# EAGLE design one_dollar_boad_beta4 (EAGLE 7.2.0)
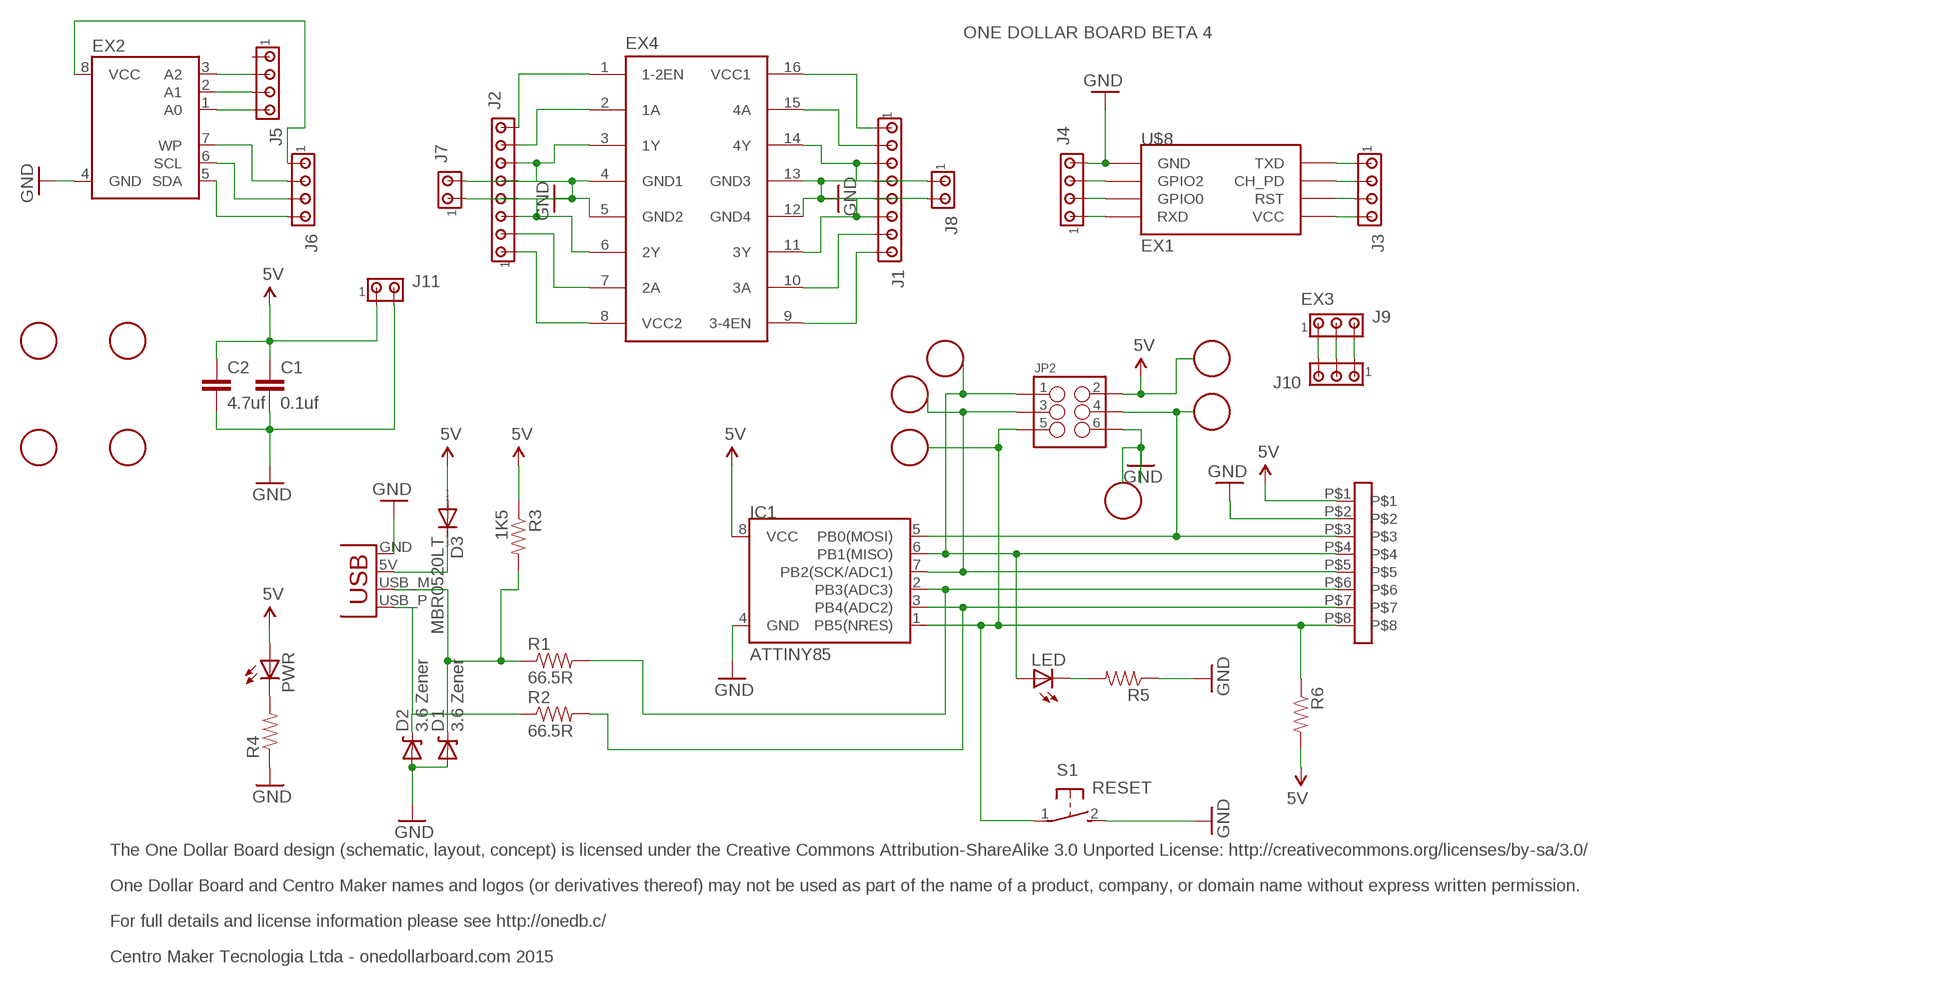
[diagram p0: schematic, sheet 1]

## Parts
C1  0.1uf  CAP0402-CAP  [0402-CAP]
C2  4.7uf  CAP0805  [0805]
CONNECTORBAR1  .  FAMALEBAR01X08  [FEMEABARRA01X08]
D1  3.6 Zener  DIODE-ZENER-BZT52  [SOD-323]
D2  3.6 Zener  DIODE-ZENER-BZT52  [SOD-323]
D3  MBR0520LT  [SOD123]
EX2  AT24CP  [DIL08]
EX4  L293D  [DIL16]
IC1  ATTINY85  ATTINY45  [SO08-EIAJ]
ICSP1  ICSP  [ICSP]
ICSP2  ICSP  [ICSP]
ICSP3  ICSP  [ICSP]
ICSP4  ICSP  [ICSP]
ICSP5  ICSP  [ICSP]
ICSP6  ICSP  [ICSP]
J1  MTA08-100  [10X08MTA]
J2  MTA08-100  [10X08MTA]
J3  MTA04-100  [10X04MTA]
J4  MTA04-100  [10X04MTA]
J5  MTA04-100  [10X04MTA]
J6  MTA04-100  [10X04MTA]
J7  MTA02-100  [10X02MTA]
J8  MTA02-100  [10X02MTA]
J9  MTA03-100  [10X03MTA]
J10  MTA03-100  [10X03MTA]
J11  MTA02-100  [10X02MTA]
JP2  M03X22X3_SILK_MALE_PTH  [2X3]
LED  LED0603  [LED-0603]
PWR  LED0603  [LED-0603]
R1  66.5R  RESISTOR0402-RES  [0402-RES]
R2  66.5R  RESISTOR0402-RES  [0402-RES]
R3  1K5  RESISTOR0402-RES  [0402-RES]
R4  RESISTOR0402-RES  [0402-RES]
R5  RESISTOR0402-RES  [0402-RES]
R6  RESISTOR0402-RES  [0402-RES]
S1  RESET  DTSM-3  [DTSM-3]
U$8  EX1  ESP01  [ESP01]
U$9  ARDUINOPINAGEM  [ARDUINOPINAGEM]
X1  USBPCB  [USB-A-PCB]

## Nets
5V: C1.1 C2.1 CONNECTORBAR1.P$1 D3.A IC1.8(VCC) J11.1 JP2.2 PWR.A R3.1 R6.2
EX1: EX4.15(4A) J1.2
GND: C1.2 C2.2 CONNECTORBAR1.P$2 D1.2(A) D2.2(A) EX2.4(GND) EX4.4(GND1) EX4.5(GND2) EX4.12(GND4) EX4.13(GND3) IC1.4(GND) J1.4 J1.5 J2.4 J2.5 J4.4 J11.2 JP2.6 R4.1 R5.1 S1.2 U$8.GND X1.GND
N$1: J9.1 J10.3
N$2: CONNECTORBAR1.P$3 IC1.5(PB0(MOSI)) JP2.4
N$3: CONNECTORBAR1.P$4 IC1.6(PB1(MISO)) JP2.1 LED.A
N$5: CONNECTORBAR1.P$5 IC1.7(PB2(SCK/ADC1)) JP2.3
N$6: CONNECTORBAR1.P$7 IC1.3(PB4(ADC2)) R2.2
N$7: EX4.1(1-2EN) J2.8
N$9: EX4.2(1A) J2.7
N$10: D1.1(C) R1.1 R3.2 X1.USB_M(D-)
N$11: D2.1(C) R2.1 X1.USB_P(D+)
N$12: LED.C R5.2
N$13: EX2.8(VCC) J6.1
N$14: EX2.7(WP) J6.2
N$15: EX4.3(1Y) J2.6 J7.2
N$16: D3.C X1.5V(VBUS)
N$17: PWR.C R4.2
N$18: EX4.8(VCC2) J2.1
N$19: EX4.7(2A) J2.2
N$20: EX4.6(2Y) J2.3 J7.1
N$21: EX4.16(VCC1) J1.1
N$23: EX2.6(SCL) J6.3
N$24: EX2.5(SDA) J6.4
N$25: EX4.14(4Y) J1.3 J8.1
N$26: EX4.9(3-4EN) J1.8
N$27: EX4.10(3A) J1.7
N$28: EX2.3(A2) J5.2
N$29: J4.3 U$8.GPIO2
N$30: J4.2 U$8.GPIO0
N$31: J4.1 U$8.RX(RXD)
N$32: J3.1 U$8.TX(TXD)
N$33: J3.2 U$8.CH_PD
N$34: J3.3 U$8.RST
N$35: J3.4 U$8.VCC
N$36: EX2.2(A1) J5.3
N$37: EX2.1(A0) J5.4
N$38: EX4.11(3Y) J1.6 J8.2
N$41: J9.2 J10.2
N$46: CONNECTORBAR1.P$6 IC1.2(PB3(ADC3)) R1.2
N$47: CONNECTORBAR1.P$8 IC1.1(PB5(NRES)) JP2.5 R6.1 S1.1
N$48: J9.3 J10.1
Unconnected: J5.1

## Notes on the sheet
- ONE DOLLAR BOARD BETA 4
- EX3
- The One Dollar Board design (schematic, layout, concept) is licensed under the Creative Commons Attribution-ShareAlike 3.0 Unported License: http://creativecommons.org/licenses/by-sa/3.0/
- One Dollar Board and Centro Maker names and logos (or derivatives thereof) may not be used as part of the name of a product, company, or domain name without express written permission.
- For full details and license information please see http://onedb.c/
- Centro Maker Tecnologia Ltda - onedollarboard.com 2015

## Library data of the parts
C1 C2 = SparkFun:CAP: Capacitor Standard 0603 ceramic capacitor, and 0.1" leaded capacitor.
CONNECTORBAR1 = femeabarra01x08:FAMALEBAR01X08: conector barra femea 01x08 SMD
D1 D2 = SparkFun:DIODE-ZENER: Zener Diode Production Part - 8199 3.4V Zener Voltage
D3 = diode:MBR0520LT: SCHOTTKY BARRIER RECTIFIER Source: http://onsemi.com .. MBR0520LT1-D.pdf
EX2 = atmel:AT24C*: 2-wire serial EEPROM; MPN: AT24C1024BW-SH-B; OC_FARNELL: 1362646; OC_NEWARK: 03P2044
EX4 = st-microelectronics:L293D: PUSH-PULL 4 CHANNEL DRIVER; MPN: L293D; OC_FARNELL: 9589619; OC_NEWARK: 56P8249
IC1 = SparkFun:ATTINY45: Atmel ATTiny45
ICSP1-ICSP6 = ICSP:ICSP
J1 J2 = con-amp:MTA08-100: AMP connector
J3-J6 = con-amp:MTA04-100: AMP connector
J7 J8 J11 = con-amp:MTA02-100: AMP connector
J9 J10 = con-amp:MTA03-100: AMP connector
JP2 = SparkFun-Connectors:M03X2: 2x3 .1" header. Shrouded, with keying- CONN-10681 SMT- CONN-11415 Pogo pins- HW-11044; PROD_ID: CONN-09701
LED PWR = SparkFun:LED: LEDs Standard schematic elements and footprints for 5mm, 3mm, 1206, and 0603 sized LEDs. 5mm - Spark Fun Electronics SKU : COM-00529 (and others)
R1-R6 = SparkFun:RESISTOR: Resistor Basic schematic elements and footprints for 0603, 1206, and PTH resistors.
S1 = switch-tact:DTSM-3
U$8 = esp8266modules:ESP01: ESP8266 Wifi module 01
U$9 = arduinopinagem:ARDUINOPINAGEM
X1 = SparkFun:USB: USB Connectors USB-B-PTH is fully proven SKU : PRT-00139 USB-miniB is fully proven SKU : PRT-00587 USB-A-PCB is untested. USB-A-H is throughly reviewed, but untested. Spark Fun Electronics SKU : PRT-00437 USB-B-SMT is throughly reviewed, but untested. Needs silkscreen touching up. USB-A-S has not been used/tested USB-MB-H has not been used/tested

## Board
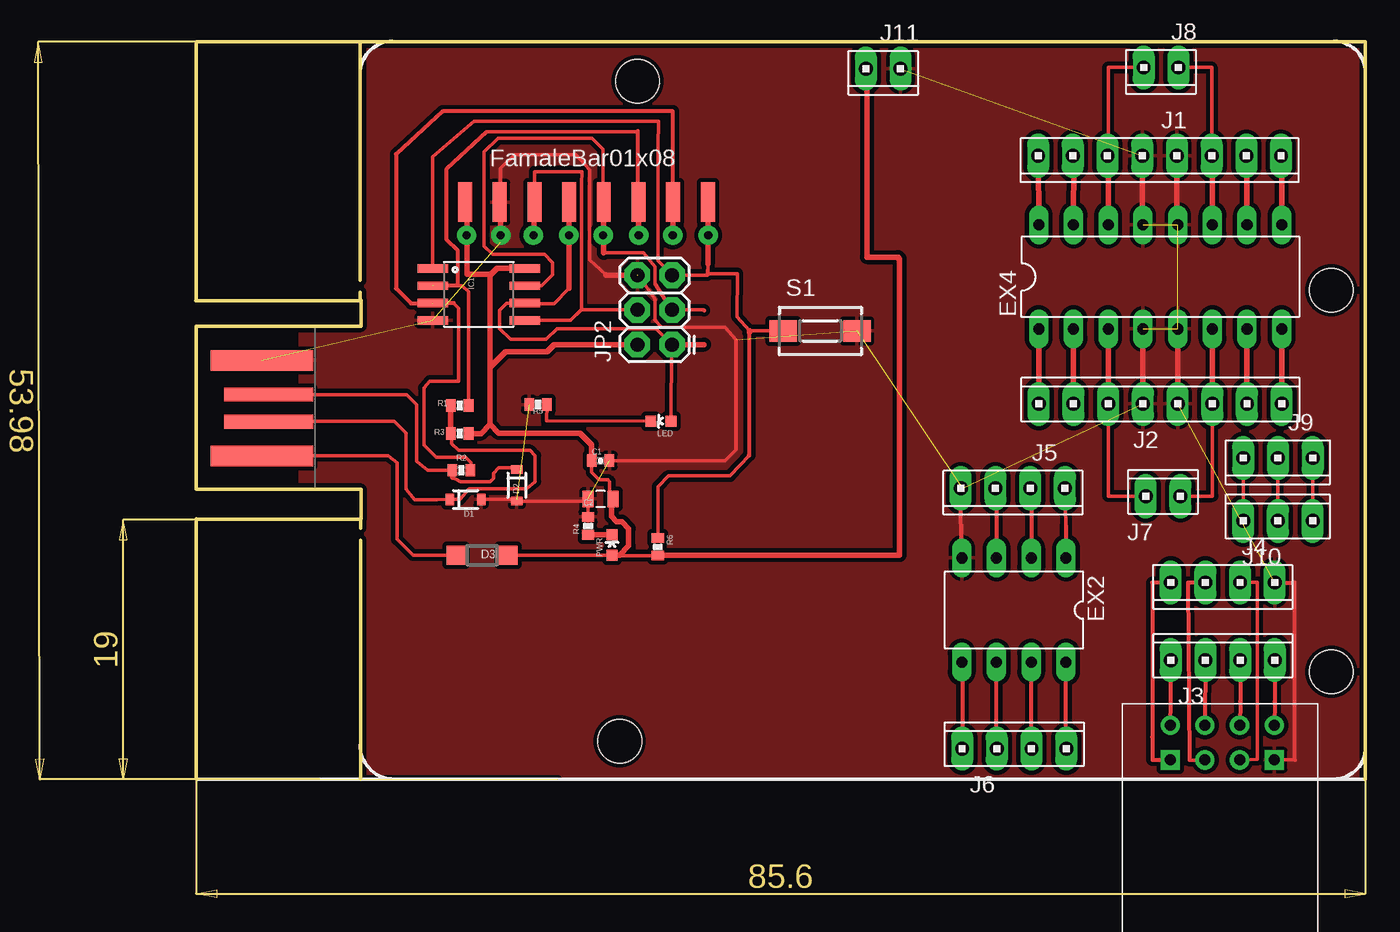
[diagram p1: board, top side]

Size 85.62 x 53.98 mm. Coordinates in mm from the lower left corner, seen from the top.
Outline: 9.02,0 26.52,0
Outline: 0.02,0 0.02,19.05
Outline: 12.08,19.05 12.08,21.21 0.02,21.21 0.02,33.15 12.08,33.15 12.08,35.05
Outline: 0.02,35.05 0.02,53.98 85.62,53.98 85.62,0
Outline: 12.03,35.65 12.03,34.96
Outline: 12.03,46.43 12.03,45.72
Outline: 12.03,47.55 12.03,46.84
Outline: 12.03,48.67 12.03,47.95
Outline: 12.03,49.81 12.03,49.1
Outline: 12.03,50.98 12.03,50.27
Outline: 12.03,52.09 12.03,51.38
Outline: 12.03,53.92 12.03,36.5
Outline: 10.79,35.03 11.5,35.03
Outline: 9.67,35.03 10.38,35.03
Outline: 8.55,35.03 9.26,35.03
Outline: 7.38,35.03 8.09,35.03
Outline: 6.27,35.03 6.98,35.03
Outline: 5.15,35.03 5.86,35.03
Outline: 4.03,35.03 4.74,35.03
Outline: 2.91,35.03 3.62,35.03
Outline: 1.8,35.03 2.51,35.03
Outline: 0,35.03 12.06,35.03
Outline: 12.06,18.36 12.06,19.07
Outline: 12.06,7.62 12.06,8.33
Outline: 12.06,6.5 12.06,7.21
Outline: 12.06,5.38 12.06,6.1
Outline: 12.06,4.24 12.06,4.95
Outline: 12.06,3.07 12.06,3.79
Outline: 12.06,1.96 12.06,2.67
Outline: 12.06,0.03 12.06,17.5
Outline: 0.06,19.02 12.07,19.02
Outline: 9.64,19.02 10.36,19.02
Outline: 8.53,19.02 9.24,19.02
Outline: 7.36,19.02 8.07,19.02
Outline: 6.24,19.02 6.95,19.02
Outline: 5.12,19.02 5.83,19.02
Outline: 4.01,19.02 4.72,19.02
Outline: 2.89,19.02 3.6,19.02
Outline: 1.77,19.02 2.48,19.02
Outline: 0.47,19.02 1.34,19.02
Copper layers (1*16): Top 0.035mm / dielectric 1.5mm / Bottom 0.035mm
Design rules "DFRobot_Eagle_Rule_v0.4": minimum track width 6mil, minimum drill 12mil, track to track 6mil, track to pad 6mil, pad to pad 6mil, via to via 6mil, smd to smd 0mil, copper to edge 10mil, drill to drill 10mil, minimum pad ring 12mil, minimum via ring 8mil, stop-mask expansion 2mil, vias tented up to drill 25mil, thermal gap 10mil

### Footprints (pad centres in the part's own frame; a part is rotated, then mirrored left to right if it is on the bottom)
0402-CAP = smd 0.7 x 0.9: 1 -0.65,0; 2 0.65,0
0805 = smd 0.8 x 1.2: 1 -0.9,0; 2 0.9,0
FEMEABARRA01X08 = smd 1.02 x 2.9: P$1 0,0; P$2 2.54,0; P$3 5.08,0; P$4 7.62,0; P$5 10.16,0; P$6 12.7,0; P$7 15.24,0; P$8 17.78,0
SOD-323 = smd 0.63 x 0.83: 1 -1.15,0; 2 1.15,0
SOD123 = smd 1.4 x 1.4: A 1.9,0; C -1.9,0
DIL08 = drill 0.813 long: 1 -3.81,-3.81; 2 -1.27,-3.81; 3 1.27,-3.81; 4 3.81,-3.81; 5 3.81,3.81; 6 1.27,3.81; 7 -1.27,3.81; 8 -3.81,3.81
DIL16 = drill 0.813 long: 1 -8.89,-3.81; 2 -6.35,-3.81; 3 -3.81,-3.81; 4 -1.27,-3.81; 5 1.27,-3.81; 6 3.81,-3.81; 7 6.35,-3.81; 8 8.89,-3.81; 9 8.89,3.81; 10 6.35,3.81; 11 3.81,3.81; 12 1.27,3.81; 13 -1.27,3.81; 14 -3.81,3.81; 15 -6.35,3.81; 16 -8.89,3.81
SO08-EIAJ = smd 0.61 x 2.21: 1 -1.905,-3.378; 2 -0.635,-3.378; 3 0.635,-3.378; 4 1.905,-3.378; 5 1.905,3.353; 6 0.635,3.353; 7 -0.635,3.353; 8 -1.905,3.353
10X08MTA = drill 1.016 long: 1 8.89,0; 2 6.35,0; 3 3.81,0; 4 1.27,0; 5 -1.27,0; 6 -3.81,0; 7 -6.35,0; 8 -8.89,0
10X04MTA = drill 1.016 long: 1 3.81,0; 2 1.27,0; 3 -1.27,0; 4 -3.81,0
10X02MTA = drill 1.016 long: 1 1.27,0; 2 -1.27,0
10X03MTA = drill 1.016 long: 1 2.54,0; 2 0,0; 3 -2.54,0
2X3 = drill 1.016 pad 1.88 octagon: 1 0,0; 2 0,2.54; 3 2.54,0; 4 2.54,2.54; 5 5.08,0; 6 5.08,2.54
LED-0603 = smd 0.8 x 0.8: A 0,-0.75; C 0,0.75
0402-RES = smd 0.7 x 0.9: 1 -0.65,0; 2 0.65,0
DTSM-3 = smd 2 x 1.6: 1 -2.7,0; 2 2.7,0
ESP01 = drill 0.8: CH_PD -1.285,-8.178; GPIO0 1.255,-5.638; GPIO2 -1.285,-5.638; RST 1.255,-8.178; TX -3.825,-8.178; VCC 3.795,-8.178 | drill 0.8 square: GND -3.825,-5.638; RX 3.795,-5.638
ARDUINOPINAGEM = hole 3.2: 0,0; 1.3,48.3; 52.1,5.1; 52.1,33
USB-A-PCB = smd 7.5 x 1.5: 5V -0.2,-3.5; GND -0.2,3.5 | smd 6.5 x 1: USB_M 0.3,-1; USB_P 0.3,1

### Placement (x,y rotation side)
C1  29.63,23.31 0 top
C2  29.63,20.5 180 top
CONNECTORBAR1  19.7,42.23 0 top
D1  19.74,20.46 0 top
D2  23.49,21.5 270 top
D3  20.96,16.39 0 top
EX2  59.88,12.38 180 top
EX4  70.6,36.75 0 top
IC1  20.73,35.47 270 top
ICSP1  37.22,37 0 top
ICSP2  37.22,34.3 0 top
ICSP3  37.22,31.9 0 top
ICSP4  30.02,37 0 top
ICSP5  30.02,34.4 0 top
ICSP6  30.02,31.8 0 top
J1  70.55,45.62 180 top
J2  70.6,27.46 0 top
J3  75.18,8.71 0 top
J4  75.17,14.39 180 top
J5  59.81,21.29 180 top
J6  59.91,2.23 0 top
J7  70.81,20.71 0 top
J8  70.65,52.08 180 top
J9  79.22,23.5 180 top
J10  79.22,18.9 0 top
J11  50.32,52 180 top
JP2  34.87,31.8 90 top
LED  34.05,26.19 90 top
PWR  30.46,17.15 0 top
R1  19.32,27.34 0 top
R2  19.44,22.6 0 top
R3  19.32,25.29 180 top
R4  28.71,18.53 270 top
R5  25.05,27.41 0 top
R6  33.82,17 270 top
S1  45.71,32.8 0 top
U$8  75.13,-4.23 180 top
U$9  31.03,2.77 0 top
X1  5.02,27.15 0 top

### Tracks (layer width: path | path; a pad name or v marks a point on that pad's centre or on a via)
5V
  Top 0.254: D3.A 30.45,16.39 PWR.A 30.46,16.35 R6.2 | IC1.8 24.09,37.39 24.6,37.19 24.6,37.26 | C1.1 28.98,22.45 29.53,21.89 30.17,21.89 30.29,21.77 30.29,20.73 C2.1
  Top 0.406: C2.1 30.42,20.4 30.42,19.23 30.8,18.85 31.18,18.85 31.69,18.34 31.69,17.07 31.02,16.4 PWR.A 30.51,16.35 | R3.1 20.86,25.29 21.53,25.96 | 21.53,25.96 21.53,30.15 | 21.53,30.15 21.53,36.88 | 21.53,36.88 22.04,37.39 IC1.8 | 21.53,30.15 22.67,31.29 25.72,31.29 26.23,31.8 JP2.2 | C1.1 28.98,24.48 28.14,25.32 22.17,25.32 21.53,25.96 | CONNECTORBAR1.P$1 19.85,42.23 19.85,36.93 21.53,36.93 21.53,36.88 | J11.1 49.12,52 49.12,38.2 51.42,38.2 51.42,38.1 51.52,38.1 51.52,16.4 33.82,16.4 R6.2
EX1
  Top 0.254: 64.28,45.59 J1.2
  Top 0.406: EX4.15 64.28,45.59
GND  (via drill 0.6 pad 1.42)  (13 unrouted)
  Top 0.254: D1.2 23.48,20.46 D2.2 28.58,20.35 C2.2 28.73,19.2 R4.1 | 32.35,36.91 33.6,35.1 33.6,33.58 34.1,33.07 38.74,33.07 39.55,32.16 39.55,24.1 38.74,23.29 30.3,23.29 C1.2 | CONNECTORBAR1.P$2 22.34,42.13 22.34,41.72 22.32,41.69 | 22.32,42.4 22.32,44.7 23.32,45.7 27.82,45.7 28.82,44.6 28.82,38 30.02,36.9 32.31,36.9 JP2.6
  Top 0.305: EX2.4 55.97,21.16 | J4.4 80.42,14.39 80.42,1.5 80.45,1.4 U$8.GND
  Top 0.406: 22.32,41.69 v22.32,39.8 | v22.32,39.8 22.32,39.3 | 55.97,21.16 56.12,21.3 | v22.32,39.8 22.32,42.4 | EX4.12 71.82,40.56 J1.5 | EX4.13 69.28,40.56 J1.4 | J2.4 EX4.5 | EX4.4 J2.5 | JP2.6 30.02,36.88 30.02,36.9
  pour Top (isolate 0.305): 0.14,-0.03 85.62,0 85.62,53.98 0.02,54 -0.03,35.03 12.08,35.05 12.08,33.15 7.64,33.15 7.64,21.21 12.08,21.21 12.08,19.05 0.02,19 0.02,0.1
N$1
  Top 0.254: J10.3 J9.1
N$2
  Top 0.254: 27.44,33.57 28.25,34.37 JP2.4 | IC1.5 27.44,33.57 | 27.44,33.57 28.25,34.37 28.25,43.57 28.27,44.45 24.81,44.45 24.76,39.3 | 24.76,42.25 CONNECTORBAR1.P$3
  Top 0.406: 24.76,39.3 24.76,42.25
N$3
  Top 0.254: 27.32,35.92 26.2,34.8 24.12,34.8 IC1.6 22.76,34.84 22.24,34.31 22.24,32.97 23.03,32.18 25.65,32.18 26.43,32.97 33.7,32.97 JP2.1 34.87,31.84 34.82,31.8 LED.A
  Top 0.406: CONNECTORBAR1.P$4 27.32,35.92
N$4
  Top 0.406: 34.82,31.8 37.22,31.8
N$5
  Top 0.254: 29.85,38.51 32.78,38.51 33.6,37.49 33.6,36.25 34.81,34.33 37.21,34.3 | IC1.7 25.32,36.11 26.12,36.9 26.12,37.8 25.52,38.4 21.72,38.4 21.12,39 21.12,45.9 22.12,46.9 29.02,46.9 29.82,46.1 29.82,42.27 CONNECTORBAR1.P$5
  Top 0.305: CONNECTORBAR1.P$5 29.96,42.11 30,42.17 30.17,42.29 29.94,42.51 29.94,42.32 29.95,41.55 29.96,41.71 | 37.21,34.3 JP2.3
  Top 0.406: CONNECTORBAR1.P$5 29.86,40.3 29.85,38.51
N$6  (2 unrouted)
  Top 0.254: 18.88,34.84 19.25,34.47 19.25,29.11 18.23,29.13 17.11,29.13 16.71,28.63 16.71,24.43 17.59,23.55 19.75,23.55 20.13,23.16 20.13,22.52 R2.2
  Top 0.305: 18.88,34.84 17.38,34.84 17.37,34.82 17.34,34.82 IC1.3 | 34.94,39.34 34.92,48.86 18.07,48.86 14.65,45.74 14.65,35.92 15.74,34.82 17.34,34.82
  Top 0.406: CONNECTORBAR1.P$7 34.94,39.34
N$7
  Top 0.406: J2.8 EX4.1
N$8  (via drill 0.6 pad 1.42)
  other vias: 19.82,39.8
N$9
  Top 0.406: J2.7 EX4.2
N$10
  Top 0.254: R3.2 18.74,25.22 18.74,24.56 19.25,24.05 24.45,24.05 24.83,23.67 24.83,21.77 24.2,21.26 20.01,21.26 19.34,20.46 D1.1 17.67,20.46 16.02,20.46 15.38,21.2 15.38,25.3 14.5,26.19 5.35,26.19 X1.USB_M
  Top 0.406: R3.2 R1.1
N$11
  Top 0.254: 18.79,22.09 19.37,21.77 21.53,21.77 21.79,22.02 21.79,22.4 22.17,22.78 23.49,22.78 | R2.1 17.68,22.59 16.95,22.59 16.17,23.27 16.17,27.38 15.41,28.14 7.99,28.14 7.97,28.17 5.33,28.17 X1.USB_P
  Top 0.406: R2.1 18.79,22.09 | 23.49,22.78 D2.1
N$12
  Top 0.254: R5.2 25.69,26.21 LED.C
N$13
  Top 0.254: J6.1 63.7,3.73
  Top 0.305: 63.7,3.73 EX2.8
N$14
  Top 0.254: J6.2 61.16,3.73
  Top 0.305: 61.16,3.73 EX2.7
N$15
  Top 0.254: J7.2 66.79,20.71 J2.6
  Top 0.406: EX4.3 J2.6
N$16
  Top 0.254: D3.C 15.89,16.39 14.72,17.55 14.72,23.14 14.09,23.67 4.84,23.67 X1.5V
N$17
  Top 0.254: 30.45,17.89 PWR.C
  Top 0.406: R4.2 30.46,17.89 PWR.C
N$18
  Top 0.406: EX4.8 J2.1
N$19
  Top 0.406: J2.2 EX4.7
N$20
  Top 0.254: J7.1 74.41,20.71 J2.3
  Top 0.406: EX4.6 J2.3
N$21
  Top 0.254: 61.69,45.54 J1.1
  Top 0.406: EX4.16 61.69,45.54
N$23
  Top 0.254: J6.3 58.62,3.73
  Top 0.305: 58.62,3.73 EX2.6
N$24
  Top 0.254: EX2.5 56.1,8.61
  Top 0.305: 56.1,8.61 J6.4
N$25
  Top 0.254: 66.79,45.57 J1.3 66.79,45.62 66.79,52.08 J8.1
  Top 0.406: EX4.14 66.79,45.57
N$26
  Top 0.254: 79.49,45.57 J1.8
  Top 0.406: EX4.9 79.49,45.57
N$27
  Top 0.254: 76.95,45.57 J1.7
  Top 0.406: EX4.10 76.95,45.57
N$28
  Top 0.254: J5.2 58.62,21.24
  Top 0.305: 58.62,21.24 EX2.3
N$29
  Top 0.254: U$8.GPIO2 77.71,1.45 77.69,14.39 | 76.47,14.41 J4.3
  Top 0.305: 77.69,14.39 76.47,14.41
N$30
  Top 0.254: 72.74,1.38 73.9,1.38 U$8.GPIO0
  Top 0.305: J4.2 72.64,14.39 72.74,1.38
N$31
  Top 0.305: J4.1 70.02,14.39 70.02,3.1 70.03,1.41 U$8.RX
N$32
  Top 0.305: J3.1 78.99,5.68 U$8.TX
N$33
  Top 0.305: J3.2 76.45,5.68 U$8.CH_PD
N$34
  Top 0.254: J3.3 73.9,8.69
  Top 0.305: 73.9,8.69 U$8.RST
N$35
  Top 0.305: U$8.VCC 71.37,5.66 J3.4
N$36
  Top 0.254: J5.3 61.16,21.24
  Top 0.305: 61.16,21.24 EX2.2
N$37
  Top 0.254: J5.4 63.7,18.54
  Top 0.305: 63.7,18.54 EX2.1
N$38
  Top 0.254: 74.41,45.57 J1.6 74.36,52.08 J8.2
  Top 0.406: EX4.11 74.41,45.57
N$39  (via drill 0.6 pad 1.42)
  other vias: 24.72,39.8
N$40  (via drill 0.6 pad 1.42)
  other vias: 27.32,39.8
N$41
  Top 0.254: J10.2 J9.2
N$42  (via drill 0.6 pad 1.42)
  other vias: 29.82,39.8
N$43  (via drill 0.6 pad 1.42)
  other vias: 32.42,39.8
N$44  (via drill 0.6 pad 1.42)
  other vias: 34.92,39.8
N$45  (via drill 0.6 pad 1.42)
  other vias: 37.52,39.8
N$46  (1 unrouted)
  Top 0.254: R1.2 19.97,35.65 19.5,36.12 17.36,36.12
  Top 0.305: 32.4,39.33 32.36,47.42 21.27,47.36 18.33,44.62 18.33,39.52 19.14,38.71 19.14,36.12 19.07,36.12 19.07,36.11 IC1.2
  Top 0.406: CONNECTORBAR1.P$6 32.4,39.33
N$47
  Top 0.254: S1.1 40.52,32.8 39.62,33.82 39.65,36.99 37.51,36.99 37.48,37.72 37.44,36.88 JP2.5 33.82,37.92 33.82,46.28 33.85,48.15 20.35,48.15 17.35,45.55 IC1.1 | R6.1 33.82,21.4 34.62,22.2 39.12,22.2 40.52,23.7 40.52,23.75 40.47,23.7
  Top 0.305: 40.47,23.7 40.52,23.7 40.52,32.7
  Top 0.406: CONNECTORBAR1.P$8 37.48,37.72 | 40.52,32.7 40.52,32.8
N$48
  Top 0.254: J10.1 J9.3

### Text on the board
tValues: 5v | gnd | p0 | p1 | p2 | p3 | p4 | p4 | p5 | M1 | 5v | gnd | 16 | 15 | 14 | 13 | 12 | 11 | 10 | 9 | 1 | 2 | 3 | 4 | 5 | 6 | 7 | 8 | EX3 | 4 | 3 | 2 | 1 | 3 | 2 | 1 | M2 | 3 | 2 | 1 | 1 | 2 | 3 | 4 | 5 | 6 | 7 | 8 | 5 | 6 | 7 | 8 | 5 | 6 | 7 | 8 | 1 | 2 | 3 | 4
Reference: ONE DOLLAR BOARD BETA 4 / Please download last version: / https://github.com/Onedollarboard/PCB | POWER | 5 | GND | 5V | 4 GND | 1 | 2 | 3 D+ | ISP | 2 D- | VCC +5V | MBR0520LT | POWER LED | The "One Dollar Board" Desing (schematic, layout, concept) is licensed under the Creative Commons Attribution-ShareAlike 3.0 Unported License: http://creativecommons.org/licenses/by-sa/3.0/ | For full details and license information please see http://onedollarboard.com/policy | The "Onde Dollar Board" and Centro Maker names and logos (or derivatives thereof) may not be used as part of the name of a product, company, or domain name without express written permission. | "One Dollar Board" name. logo and Centro Maker name, logo Copyright 2015 Centro Maker Tecnologia Ltda. and Claudio Olmedo All Rights Reserved